# Altium schematic sheet cpucore.SchDoc
size A4
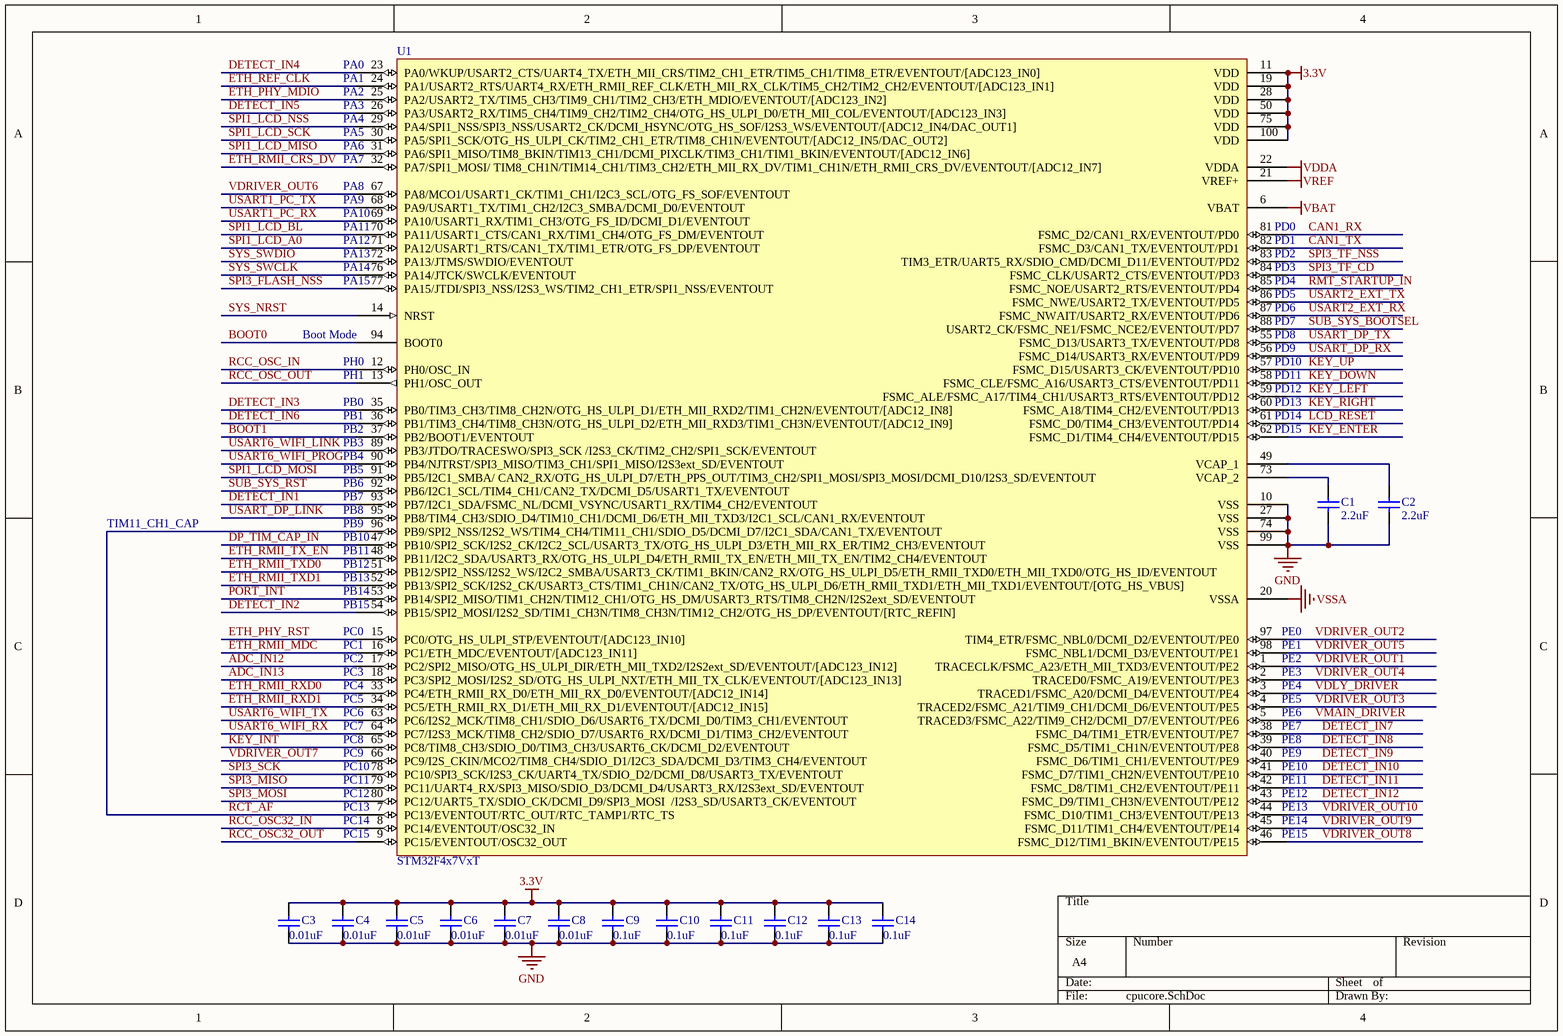
[diagram p0: cpucore.SchDoc]

## Parts
C1  2.2uF  [CAPC2012M]
C2  2.2uF  [CAPC2012M]
C3  0.01uF  [CAPC2012M]
C4  0.01uF  [CAPC2012M]
C5  0.01uF  [CAPC2012M]
C6  0.01uF  [CAPC2012M]
C7  0.01uF  [CAPC2012M]
C8  0.01uF  [CAPC2012M]
C9  0.1uF  [CAPC2012M]
C10  0.1uF  [CAPC2012M]
C11  0.1uF  [CAPC2012M]
C12  0.1uF  [CAPC2012M]
C13  0.1uF  [CAPC2012M]
C14  0.1uF  [CAPC2012M]
U1  STM32F4x7VxT  [LQFP100_L]

## Nets
3.3V: C3.2 C4.2 C5.2 C6.2 C7.2 C8.2 C9.2 C10.2 C11.2 C12.2 C13.2 C14.2 U1.11(VDD) U1.19(VDD) U1.28(VDD) U1.50(VDD) U1.75(VDD) U1.100(VDD)
GND: C1.2 C2.2 C3.1 C4.1 C5.1 C6.1 C7.1 C8.1 C9.1 C10.1 C11.1 C12.1 C13.1 C14.1 U1.10(VSS) U1.27(VSS) U1.74(VSS) U1.99(VSS)
VBAT: U1.6(VBAT)
VDDA: U1.22(VDDA)
VREF: U1.21(VREF+)
VSSA: U1.20(VSSA)
ADC_IN12: U1.17(PC2/SPI2_MISO/OTG_HS_ULPI_DIR/ETH_MII_TXD2/I2S2ext_SD/EVENTOUT/[ADC123_IN12])
ADC_IN13: U1.18(PC3/SPI2_MOSI/I2S2_SD/OTG_HS_ULPI_NXT/ETH_MII_TX_CLK/EVENTOUT/[ADC123_IN13])
BOOT0: U1.94(BOOT0)
BOOT1: U1.37(PB2/BOOT1/EVENTOUT)
CAN1_RX: U1.81(FSMC_D2/CAN1_RX/EVENTOUT/PD0)
CAN1_TX: U1.82(FSMC_D3/CAN1_TX/EVENTOUT/PD1)
DETECT_IN1: U1.93(PB7/I2C1_SDA/FSMC_NL/DCMI_VSYNC/USART1_RX/TIM4_CH2/EVENTOUT)
DETECT_IN2: U1.54(PB15/SPI2_MOSI/I2S2_SD/TIM1_CH3N/TIM8_CH3N/TIM12_CH2/OTG_HS_DP/EVENTOUT/[RTC_REFIN])
DETECT_IN3: U1.35(PB0/TIM3_CH3/TIM8_CH2N/OTG_HS_ULPI_D1/ETH_MII_RXD2/TIM1_CH2N/EVENTOUT/[ADC12_IN8])
DETECT_IN4: U1.23(PA0/WKUP/USART2_CTS/UART4_TX/ETH_MII_CRS/TIM2_CH1_ETR/TIM5_CH1/TIM8_ETR/EVENTOUT/[ADC123_IN0])
DETECT_IN5: U1.26(PA3/USART2_RX/TIM5_CH4/TIM9_CH2/TIM2_CH4/OTG_HS_ULPI_D0/ETH_MII_COL/EVENTOUT/[ADC123_IN3])
DETECT_IN6: U1.36(PB1/TIM3_CH4/TIM8_CH3N/OTG_HS_ULPI_D2/ETH_MII_RXD3/TIM1_CH3N/EVENTOUT/[ADC12_IN9])
DETECT_IN7: U1.38(FSMC_D4/TIM1_ETR/EVENTOUT/PE7)
DETECT_IN8: U1.39(FSMC_D5/TIM1_CH1N/EVENTOUT/PE8)
DETECT_IN9: U1.40(FSMC_D6/TIM1_CH1/EVENTOUT/PE9)
DETECT_IN10: U1.41(FSMC_D7/TIM1_CH2N/EVENTOUT/PE10)
DETECT_IN11: U1.42(FSMC_D8/TIM1_CH2/EVENTOUT/PE11)
DETECT_IN12: U1.43(FSMC_D9/TIM1_CH3N/EVENTOUT/PE12)
DP_TIM_CAP_IN: U1.47(PB10/SPI2_SCK/I2S2_CK/I2C2_SCL/USART3_TX/OTG_HS_ULPI_D3/ETH_MII_RX_ER/TIM2_CH3/EVENTOUT)
ETH_PHY_MDIO: U1.25(PA2/USART2_TX/TIM5_CH3/TIM9_CH1/TIM2_CH3/ETH_MDIO/EVENTOUT/[ADC123_IN2])
ETH_PHY_RST: U1.15(PC0/OTG_HS_ULPI_STP/EVENTOUT/[ADC123_IN10])
ETH_REF_CLK: U1.24(PA1/USART2_RTS/UART4_RX/ETH_RMII_REF_CLK/ETH_MII_RX_CLK/TIM5_CH2/TIM2_CH2/EVENTOUT/[ADC123_IN1])
ETH_RMII_CRS_DV: U1.32(PA7/SPI1_MOSI/_TIM8_CH1N/TIM14_CH1/TIM3_CH2/ETH_MII_RX_DV/TIM1_CH1N/ETH_RMII_CRS_DV/EVENTOUT/[ADC12_IN7])
ETH_RMII_MDC: U1.16(PC1/ETH_MDC/EVENTOUT/[ADC123_IN11])
ETH_RMII_RXD0: U1.33(PC4/ETH_RMII_RX_D0/ETH_MII_RX_D0/EVENTOUT/[ADC12_IN14])
ETH_RMII_RXD1: U1.34(PC5/ETH_RMII_RX_D1/ETH_MII_RX_D1/EVENTOUT/[ADC12_IN15])
ETH_RMII_TX_EN: U1.48(PB11/I2C2_SDA/USART3_RX/OTG_HS_ULPI_D4/ETH_RMII_TX_EN/ETH_MII_TX_EN/TIM2_CH4/EVENTOUT)
ETH_RMII_TXD0: U1.51(PB12/SPI2_NSS/I2S2_WS/I2C2_SMBA/USART3_CK/TIM1_BKIN/CAN2_RX/OTG_HS_ULPI_D5/ETH_RMII_TXD0/ETH_MII_TXD0/OTG_HS_ID/EVENTOUT)
ETH_RMII_TXD1: U1.52(PB13/SPI2_SCK/I2S2_CK/USART3_CTS/TIM1_CH1N/CAN2_TX/OTG_HS_ULPI_D6/ETH_RMII_TXD1/ETH_MII_TXD1/EVENTOUT/[OTG_HS_VBUS])
KEY_DOWN: U1.58(FSMC_CLE/FSMC_A16/USART3_CTS/EVENTOUT/PD11)
KEY_ENTER: U1.62(FSMC_D1/TIM4_CH4/EVENTOUT/PD15)
KEY_INT: U1.65(PC8/TIM8_CH3/SDIO_D0/TIM3_CH3/USART6_CK/DCMI_D2/EVENTOUT)
KEY_LEFT: U1.59(FSMC_ALE/FSMC_A17/TIM4_CH1/USART3_RTS/EVENTOUT/PD12)
KEY_RIGHT: U1.60(FSMC_A18/TIM4_CH2/EVENTOUT/PD13)
KEY_UP: U1.57(FSMC_D15/USART3_CK/EVENTOUT/PD10)
LCD_RESET: U1.61(FSMC_D0/TIM4_CH3/EVENTOUT/PD14)
PORT_INT: U1.53(PB14/SPI2_MISO/TIM1_CH2N/TIM12_CH1/OTG_HS_DM/USART3_RTS/TIM8_CH2N/I2S2ext_SD/EVENTOUT)
RCC_OSC32_IN: U1.8(PC14/EVENTOUT/OSC32_IN)
RCC_OSC32_OUT: U1.9(PC15/EVENTOUT/OSC32_OUT)
RCC_OSC_IN: U1.12(PH0/OSC_IN)
RCC_OSC_OUT: U1.13(PH1/OSC_OUT)
RCT_AF: U1.7(PC13/EVENTOUT/RTC_OUT/RTC_TAMP1/RTC_TS) U1.96(PB9/SPI2_NSS/I2S2_WS/TIM4_CH4/TIM11_CH1/SDIO_D5/DCMI_D7/I2C1_SDA/CAN1_TX/EVENTOUT)
RMT_STARTUP_IN: U1.85(FSMC_NOE/USART2_RTS/EVENTOUT/PD4)
SPI1_LCD_A0: U1.71(PA12/USART1_RTS/CAN1_TX/TIM1_ETR/OTG_FS_DP/EVENTOUT)
SPI1_LCD_BL: U1.70(PA11/USART1_CTS/CAN1_RX/TIM1_CH4/OTG_FS_DM/EVENTOUT)
SPI1_LCD_MISO: U1.31(PA6/SPI1_MISO/TIM8_BKIN/TIM13_CH1/DCMI_PIXCLK/TIM3_CH1/TIM1_BKIN/EVENTOUT/[ADC12_IN6])
SPI1_LCD_MOSI: U1.91(PB5/I2C1_SMBA/_CAN2_RX/OTG_HS_ULPI_D7/ETH_PPS_OUT/TIM3_CH2/SPI1_MOSI/SPI3_MOSI/DCMI_D10/I2S3_SD/EVENTOUT)
SPI1_LCD_NSS: U1.29(PA4/SPI1_NSS/SPI3_NSS/USART2_CK/DCMI_HSYNC/OTG_HS_SOF/I2S3_WS/EVENTOUT/[ADC12_IN4/DAC_OUT1])
SPI1_LCD_SCK: U1.30(PA5/SPI1_SCK/OTG_HS_ULPI_CK/TIM2_CH1_ETR/TIM8_CH1N/EVENTOUT/[ADC12_IN5/DAC_OUT2])
SPI3_FLASH_NSS: U1.77(PA15/JTDI/SPI3_NSS/I2S3_WS/TIM2_CH1_ETR/SPI1_NSS/EVENTOUT)
SPI3_MISO: U1.79(PC11/UART4_RX/SPI3_MISO/SDIO_D3/DCMI_D4/USART3_RX/I2S3ext_SD/EVENTOUT)
SPI3_MOSI: U1.80(PC12/UART5_TX/SDIO_CK/DCMI_D9/SPI3_MOSI__/I2S3_SD/USART3_CK/EVENTOUT)
SPI3_SCK: U1.78(PC10/SPI3_SCK/I2S3_CK/UART4_TX/SDIO_D2/DCMI_D8/USART3_TX/EVENTOUT)
SPI3_TF_CD: U1.84(FSMC_CLK/USART2_CTS/EVENTOUT/PD3)
SPI3_TF_NSS: U1.83(TIM3_ETR/UART5_RX/SDIO_CMD/DCMI_D11/EVENTOUT/PD2)
SUB_SYS_BOOTSEL: U1.88(USART2_CK/FSMC_NE1/FSMC_NCE2/EVENTOUT/PD7)
SUB_SYS_RST: U1.92(PB6/I2C1_SCL/TIM4_CH1/CAN2_TX/DCMI_D5/USART1_TX/EVENTOUT)
SYS_NRST: U1.14(NRST)
SYS_SWCLK: U1.76(PA14/JTCK/SWCLK/EVENTOUT)
SYS_SWDIO: U1.72(PA13/JTMS/SWDIO/EVENTOUT)
USART1_PC_RX: U1.69(PA10/USART1_RX/TIM1_CH3/OTG_FS_ID/DCMI_D1/EVENTOUT)
USART1_PC_TX: U1.68(PA9/USART1_TX/TIM1_CH2/I2C3_SMBA/DCMI_D0/EVENTOUT)
USART2_EXT_RX: U1.87(FSMC_NWAIT/USART2_RX/EVENTOUT/PD6)
USART2_EXT_TX: U1.86(FSMC_NWE/USART2_TX/EVENTOUT/PD5)
USART6_WIFI_LINK: U1.89(PB3/JTDO/TRACESWO/SPI3_SCK_/I2S3_CK/TIM2_CH2/SPI1_SCK/EVENTOUT)
USART6_WIFI_PROG: U1.90(PB4/NJTRST/SPI3_MISO/TIM3_CH1/SPI1_MISO/I2S3ext_SD/EVENTOUT)
USART6_WIFI_RX: U1.64(PC7/I2S3_MCK/TIM8_CH2/SDIO_D7/USART6_RX/DCMI_D1/TIM3_CH2/EVENTOUT)
USART6_WIFI_TX: U1.63(PC6/I2S2_MCK/TIM8_CH1/SDIO_D6/USART6_TX/DCMI_D0/TIM3_CH1/EVENTOUT)
USART_DP_LINK: U1.95(PB8/TIM4_CH3/SDIO_D4/TIM10_CH1/DCMI_D6/ETH_MII_TXD3/I2C1_SCL/CAN1_RX/EVENTOUT)
USART_DP_RX: U1.56(FSMC_D14/USART3_RX/EVENTOUT/PD9)
USART_DP_TX: U1.55(FSMC_D13/USART3_TX/EVENTOUT/PD8)
VDLY_DRIVER: U1.3(TRACED1/FSMC_A20/DCMI_D4/EVENTOUT/PE4)
VDRIVER_OUT1: U1.1(TRACECLK/FSMC_A23/ETH_MII_TXD3/EVENTOUT/PE2)
VDRIVER_OUT2: U1.97(TIM4_ETR/FSMC_NBL0/DCMI_D2/EVENTOUT/PE0)
VDRIVER_OUT3: U1.4(TRACED2/FSMC_A21/TIM9_CH1/DCMI_D6/EVENTOUT/PE5)
VDRIVER_OUT4: U1.2(TRACED0/FSMC_A19/EVENTOUT/PE3)
VDRIVER_OUT5: U1.98(FSMC_NBL1/DCMI_D3/EVENTOUT/PE1)
VDRIVER_OUT6: U1.67(PA8/MCO1/USART1_CK/TIM1_CH1/I2C3_SCL/OTG_FS_SOF/EVENTOUT)
VDRIVER_OUT7: U1.66(PC9/I2S_CKIN/MCO2/TIM8_CH4/SDIO_D1/I2C3_SDA/DCMI_D3/TIM3_CH4/EVENTOUT)
VDRIVER_OUT8: U1.46(FSMC_D12/TIM1_BKIN/EVENTOUT/PE15)
VDRIVER_OUT9: U1.45(FSMC_D11/TIM1_CH4/EVENTOUT/PE14)
VDRIVER_OUT10: U1.44(FSMC_D10/TIM1_CH3/EVENTOUT/PE13)
VMAIN_DRIVER: U1.5(TRACED3/FSMC_A22/TIM9_CH2/DCMI_D7/EVENTOUT/PE6)
NetC1_1: C1.1 U1.73(VCAP_2)
NetC2_1: C2.1 U1.49(VCAP_1)

## Notes on the sheet
- (near U1) PA0
- (near U1) PA1
- (near U1) PA2
- (near U1) PA3
- (near U1) PA4
- (near U1) PA5
- (near U1) PA6
- (near U1) PA7
- (near U1) PA8
- (near U1) PA9
- (near U1) PA10
- (near U1) PA11
- (near U1) PA12
- (near U1) PD1
- (near U1) PD0
- (near U1) PA13
- (near U1) PA14
- (near U1) PA15
- (near U1) PD3
- (near U1) PD5
- (near U1) PD2
- (near U1) PD4
- (near U1) PD6
- (near U1) Boot Mode
- (near U1) PH1
- (near U1) PH0
- (near U1) PD11
- (near U1) PD10
- (near U1) PD9
- (near U1) PD8
- (near U1) PD7
- (near U1) PB2
- (near U1) PB3
- (near U1) PB0
- (near U1) PB1
- (near U1) PD12
- (near U1) PD13
- (near U1) PD14
- (near U1) PD15
- (near U1) PB4
- (near U1) PB5
- (near U1) PB6
- (near U1) PB7
- (near U1) PB8
- TIM11_CH1_CAP
- (near U1) PB11
- (near U1) PB12
- (near U1) PB13
- (near U1) PB10
- (near U1) PB9
- (near U1) PB14
- (near U1) PB15
- (near U1) PC0
- (near U1) PC1
- (near U1) PE0
- (near U1) PE1
- (near U1) PC4
- (near U1) PC5
- (near U1) PC2
- (near U1) PC3
- (near U1) PC6
- (near U1) PE2
- (near U1) PE3
- (near U1) PE4
- (near U1) PE5
- (near U1) PE6
- (near U1) PC10
- (near U1) PC11
- (near U1) PC7
- (near U1) PC8
- (near U1) PC9
- (near U1) PE7
- (near U1) PE8
- (near U1) PE9
- (near U1) PE10
- (near U1) PE11
- (near U1) PC14
- (near U1) PC15
- (near U1) PC12
- (near U1) PC13
- (near U1) PE12
- (near U1) PE13
- (near U1) PE14
- (near U1) PE15

## Library data of the parts
C1-C14 = Cap: Capacitor; Value: 1nF; Published: 8-Jun-2000; LatestRevisionDate: 17-Jul-2002; LatestRevisionNote: Re-released for DXP Platform.; PackageReference: RAD-0.3; Publisher: Altium Limited
U1 = STM32F4x7VxT: STM32 ARM-based 32-bit MCU with 64 Kbytes Flash, 100-pin LQFP, Industrial Temperature; ComponentLink1Description: Manufacturer Link; ComponentLink2Description: Datasheet; ComponentLink2URL: http://www.st.com/stonline/products/literature/ds/13587.pdf; DatasheetVersion: rev6, Mar-2008; PackageDescription: 100-Pin Low-Profile Quad Flat Pack, 14 x 14 mm Body, 0.5 mm Pitch (LQFP100); PackageReference: LQFP100; PackageVersion: Mar-2008; Published: 30-May-2008; Publisher: Altium Limited; ComponentLink1URL: www.st.com/stm32